# Altium project BoostConverter3-12V.PrjPcb
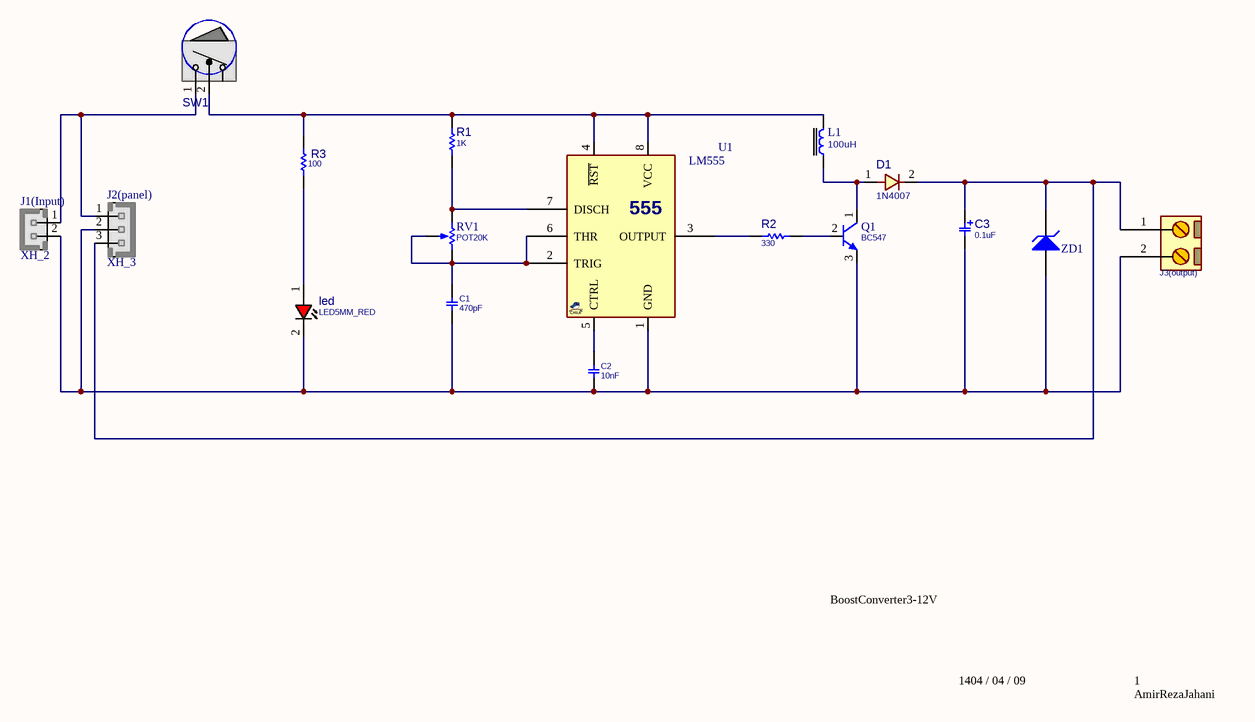
[diagram p0: Sheet1.SchDoc]
1 sheet, 17 parts. Net scope: global (net labels, ports and power ports of the same name join across sheets).
Board file: PCB1.PcbDoc

## Sheet Sheet1.SchDoc
size A4; SheetNumber: 1; SheetTotal: 1

### Parts
C1  470pF  [C_CER_D5]
C2  10nF  [C_CER_D5]
C3  0.1uF  [C_EL_12X25]
D1  1N4007  [D_AX04_DO41]
J1(Input)  XH_2  [XH_2]
J2(panel)  XH_3  [XH_3]
J3(output)  CONN_TB2  [TBB_2]  (value not drawn)
L1  100uH  [LTOR_25X10]
led  LED5MM_RED  [LED5MM_RED]
Q1  BC547  [TO92_3]
R1  1K  [R025W_AX04]
R2  330  [R025W_AX04]
R3  100  [R025W_AX04]
RV1  POT20K  [VOL_R]
SW1  ToggleSwitch  [SWRCK_SPST_S_15X10]  (value not drawn)
U1  LM555  [DIP_8]
ZD1  Diode Zener  [Diode 1W]  (value not drawn)

### Nets
NetC1_1: C1.1 C2.1 C3.2 J1(Input).2 J2(panel).2 J3(output).2 led.2(CATHODE) Q1.3(E) U1.1(GND) ZD1.1(A)
NetC1_2: C1.2 RV1.2(TAP) RV1.3(BOT) U1.2(TRIG) U1.6(THR)
NetC2_2: C2.2 U1.5(CTRL)
NetC3_1: C3.1 D1.2 J2(panel).3 J3(output).1 ZD1.2(K)
NetD1_1: D1.1 L1.1 Q1.1(C)
NetJ1(Input)_1: J1(Input).1 J2(panel).1 SW1.1(T1)
NetL1_2: L1.2 R1.2 R3.2 SW1.2(COM) U1.4(~{RST}) U1.8(VCC)
Netled_1: led.1(ANODE) R3.1
NetQ1_2: Q1.2(B) R2.2
NetR1_1: R1.1 RV1.1(TOP) U1.7(DISCH)
NetR2_1: R2.1 U1.3(OUTPUT)

### Notes on the sheet
- BoostConverter3-12V
- 1404 / 04 / 09
- 1
- AmirRezaJahani
- (in symbol LM555_DIP8) 555

### Library data of the parts
C1 C2 = CAP_THD_CER: CAP, THD, CER MULTI LAYER,; DESC: CAP, CER MULTI LAYER,; MANF_P#: MANF_PART#; PARAM2: 50V; PRICE: 100= 1$; MANF: MANF; ASSEMBLY: ASSEMBLY
  C1: VALUE: 470pF
  C2: VALUE: 10nF
C3 = CAP_THD_EL: CAP, THD, ELEC,; MANF_P#: MANF_PART#; PARAM2: 25V; DESC: DESCRIPTION; DIST#: MOUSER; PARAM: 20%; PRICE: 10= 5$; MANF: MANF; ASSEMBLY: ASSEMBLY; VALUE: 0.1uF
D1 = DIODE_THD: DIODE, THD; DESC: DESCRIPTION; PARAM: 100V; PARAM2: 1A; MANF_P#: 1N4001; MANF: MANF; ASSEMBLY: ASSEMBLY; PRICE: PRICE; VALUE: 1N4007
J1(Input) = XH_2: PW10-x-M, JST-BxB-XH-A pitch: 2.5mm, 3A/250v; MANF: JST; MANF_P#: B2B-XH-A; PARAM2: 250v; PARAM: 3.0A; VALUE: XH_2
J2(panel) = XH_3: PW10-x-M, JST-BxB-XH-A pitch: 2.5mm, 3A/250v; MANF: JST; MANF_P#: B3B-XH-A; PARAM2: 250v; PARAM: 3.0A; VALUE: XH_3
J3(output) = CONN_TB2: CONN, TERMINAL BLOCK, 5.08mm pitch; VALUE: CONN_TB2
L1 = IND_THD: INDUCTOR, THD; VALUE: 100uH
led = LED_THD_5MM_RED: LED, THD, 5MM, RED; DESC: DESCRIPTION; MANF_P#: MANF_PART#; PARAM2: 2.2V; MANF: MANF; ASSEMBLY: ASSEMBLY; PRICE: PRICE; VALUE: LED5MM_RED
Q1 = NPN_BC547_TO92: BJT, NPN, 45v, 0.1A, THD, TO92; PARAM: 0.1A, Hfe110~800; PARAM2: 45v, 500mW; MANF: FAIRCHILD; MANF_P#: BC547; VALUE: BC547
R1-R3 = RES_THD: RESISTOR, THD; MANF_P#: RK73H1ETTP4701F; MANF: KOA SPEER; PARAM: 0.063W; DESC: DESCRIPTION; DIST#: MOUSER; PARAM2: 1%; ASSEMBLY: ASSEMBLY; PRICE: 100= 0.5$
  R1: VALUE: 1K
  R2: VALUE: 330
  R3: VALUE: 100
RV1 = RES_THD_POT_VOL: RESISTOR, THD, Potentiometer Volume; VALUE: POT20K
SW1 = SWROK_SPST_R_15X10: SWITCH, Rocker, SPST, THD, 15x10.5mm; DESC: DESCRIPTION; MANF: -; MANF_PART#: -; VALUE: ToggleSwitch; ASSEMBLY: ASSEMBLY; PARAM: -; PRICE: -
U1 = LM555_DIP8: 555 Timer,; MANF: Fairchild, Texas Instruments; MANF_P#: LM555CN; PARAM2: 4.5~16V; PARAM: 200mA output; VALUE: LM555
ZD1 = Diode Zener: Zener Diode; Designer: Saeid Jorablo; Company: E.P.I.L; Voltage: 3.3 V; Design Date: 2011/11/02